# Altium schematic sheet COVER PAGE.SchDoc
size A3; ApprovedBy: Enes Mercan; CompanyName: HurSAT; Engineer: Enes Mercan; Revision: 1.00.00; SheetNumber: 1; SheetTotal: 5; DesignedBy: Enes Mercan; PageSize: A3
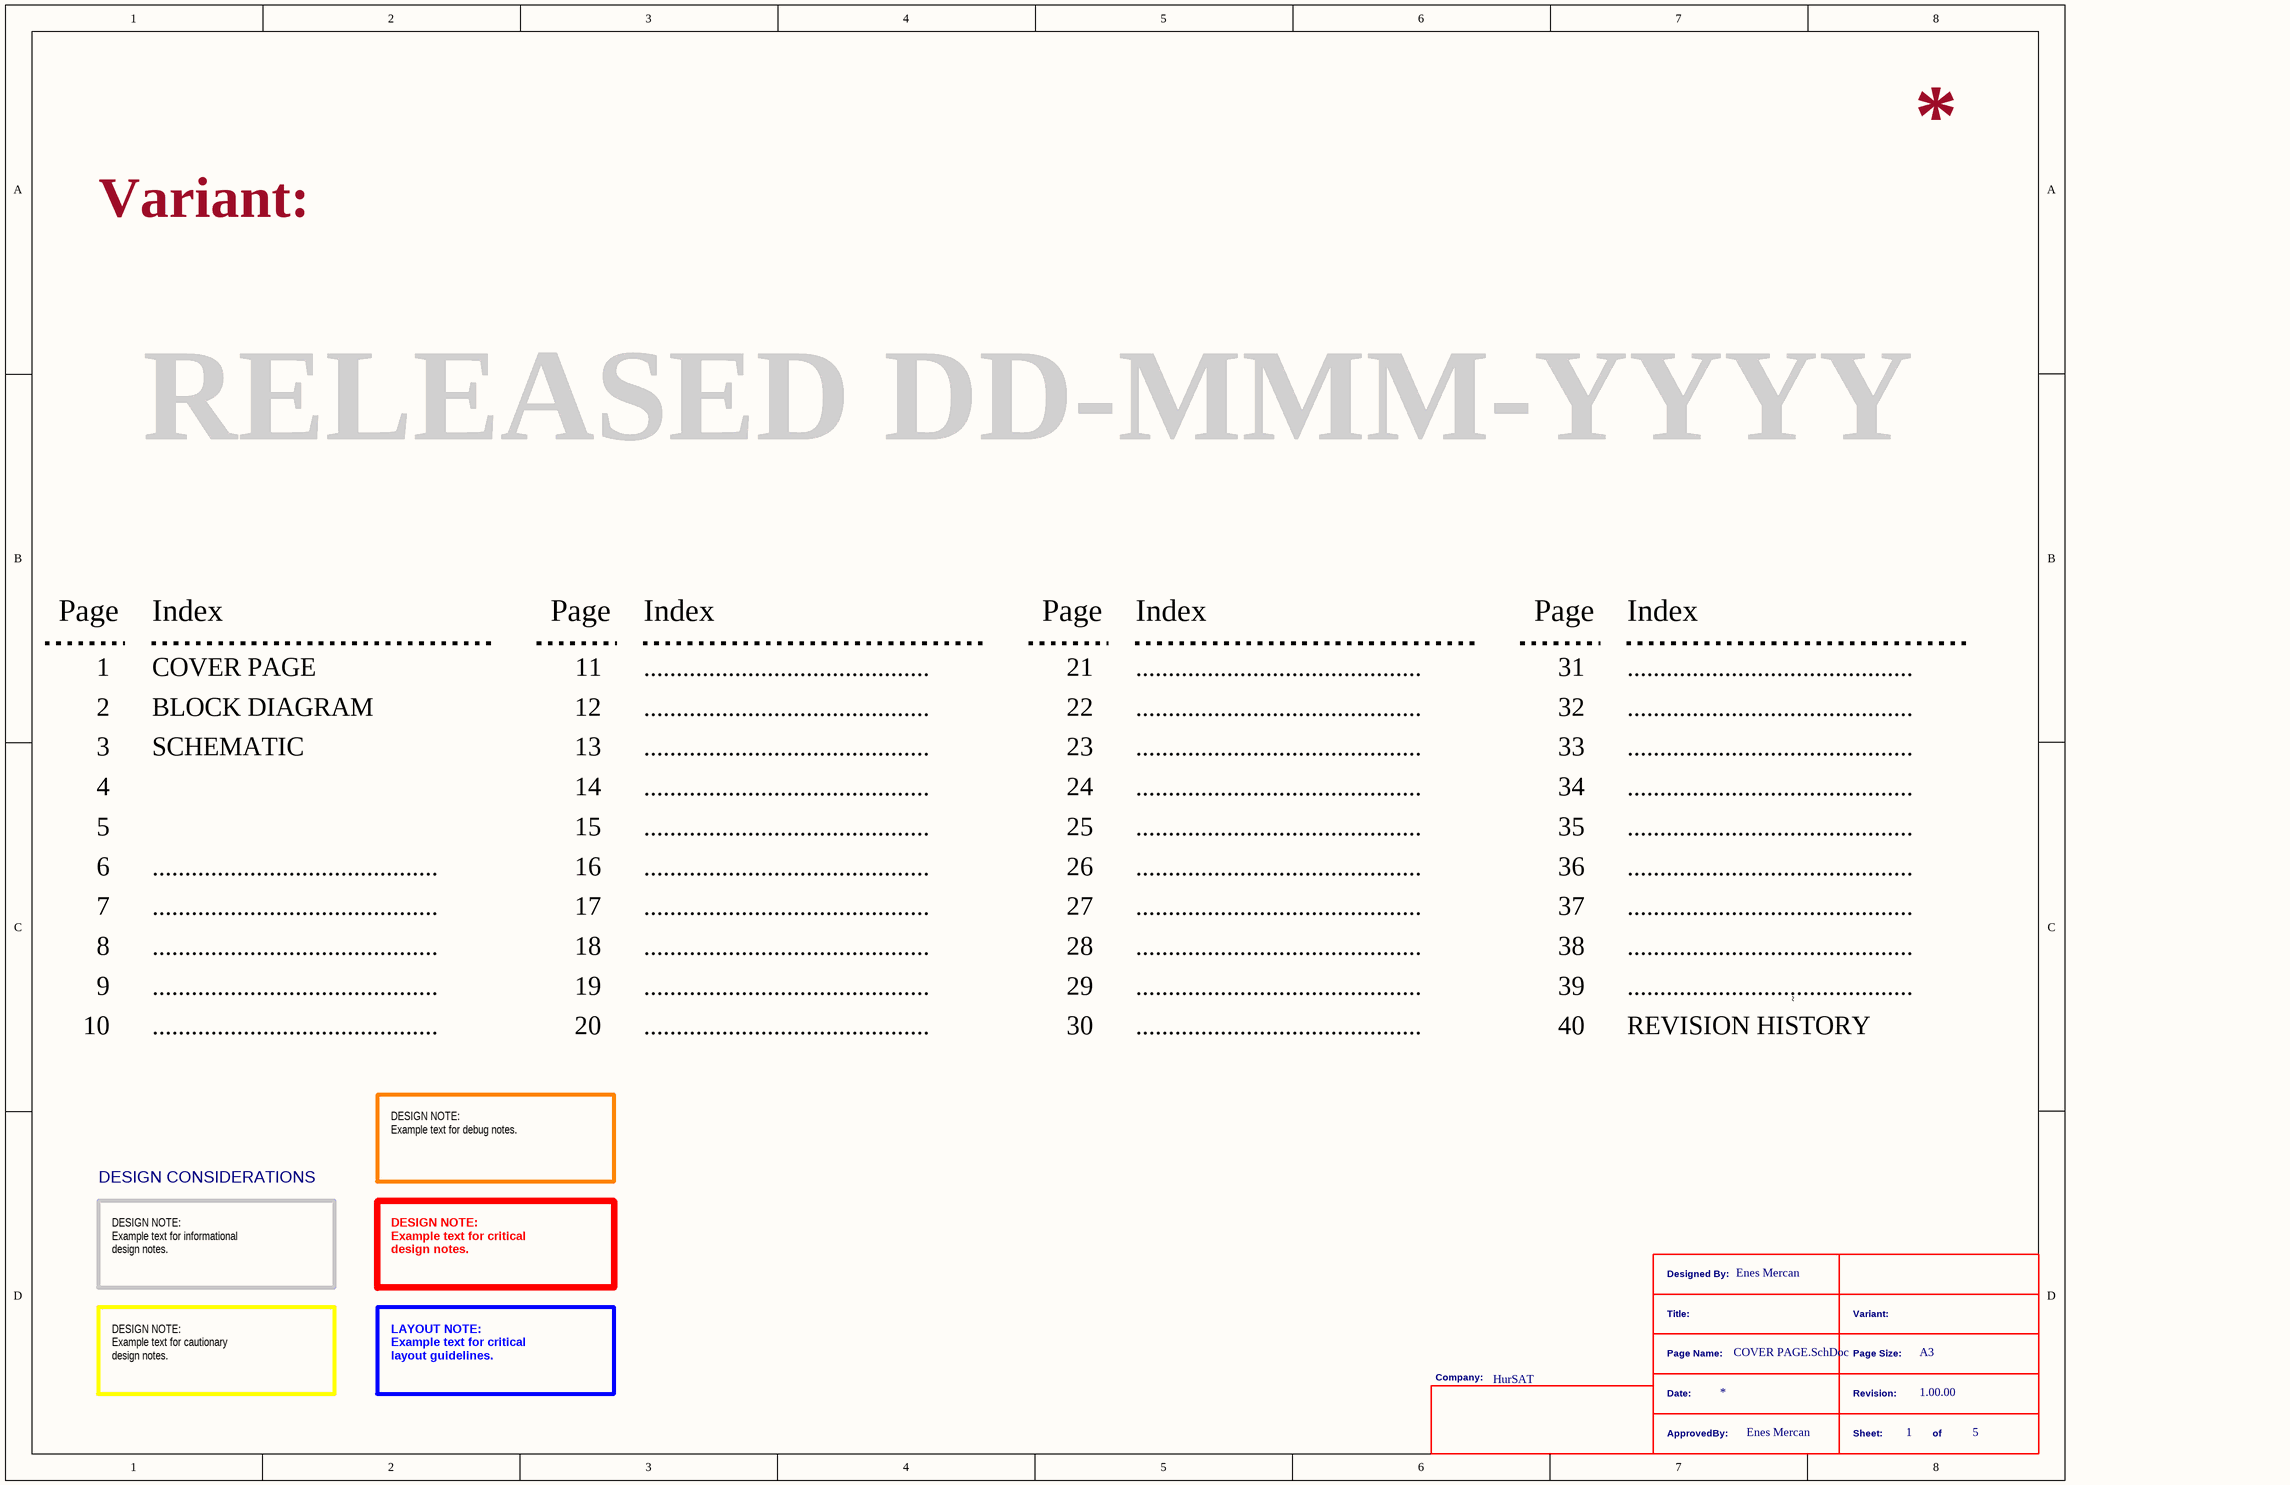
[diagram p0: COVER PAGE.SchDoc]

## Notes on the sheet
- Variant:
- RELEASED DD-MMM-YYYY
- Page
- Index
- 1
- COVER PAGE
- 11
- ............................................
- 21
- 31
- 2
- 3
- BLOCK DIAGRAM
- SCHEMATIC
- 12
- 13
- 22
- 23
- 32
- 33
- 4
- 5
- 14
- 15
- 24
- 25
- 34
- 35
- 6
- 16
- 26
- 36
- 7
- 8
- 17
- 18
- 27
- 28
- 37
- 38
- 9
- 10
- 19
- 20
- 29
- 30
- 39
- 40
- REVISION HISTORY
- DESIGN NOTE:
  Example text for debug notes.
- DESIGN CONSIDERATIONS
- DESIGN NOTE:
  Example text for informational
  design notes.
- DESIGN NOTE:
  Example text for critical
  design notes.
- DESIGN NOTE:
  Example text for cautionary
  design notes.
- LAYOUT NOTE:
  Example text for critical
  layout guidelines.
- ~
- Designed By:
- Title:
- Page Name:
- Page Size:
- Company:
- ApprovedBy:
- Date:
- Sheet:
- Revision:
- of